# EAGLE schematic gL_control_PCB (EAGLE 7.7.0)
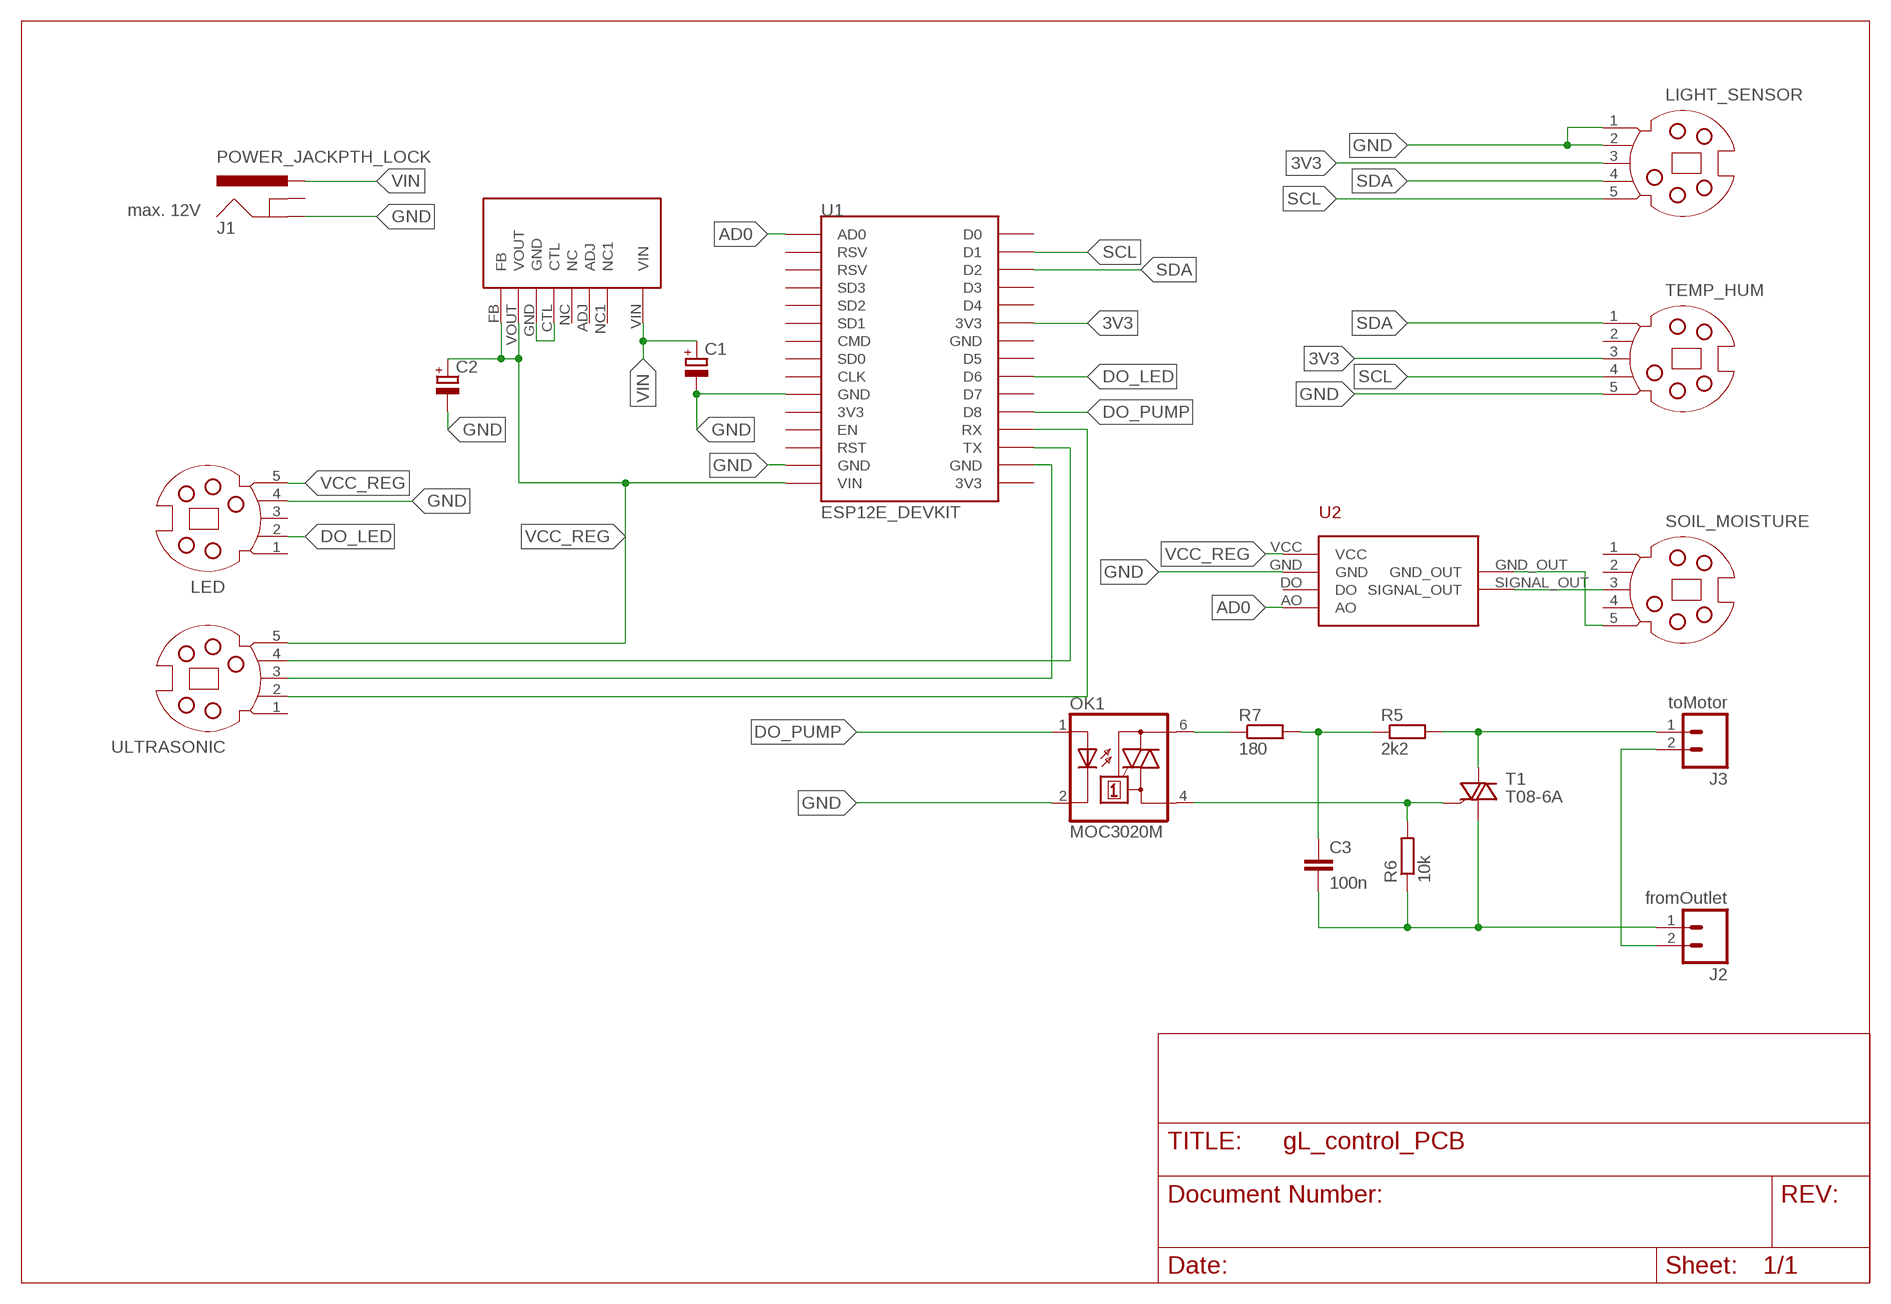
[diagram p0: schematic, sheet 1]

## Parts
C1  CPOL-EUE2.5-5  [E2,5-5]
C2  CPOL-EUE5-8.5  [E5-8,5]
C3  100n  C7.5/5  [C7.5B5]
J1  POWER_JACKPTH_LOCK  [POWER_JACK_PTH_LOCK]
J2  fromOutlet  M025MM  [SCREWTERMINAL-5MM-2]
J3  toMotor  M025MM  [SCREWTERMINAL-5MM-2]
LED  MD05SS  [MDIN05SS]
LIGHT_SENSOR  MD05SS  [MDIN05SS]
OK1  MOC3020M  [DIL06]
R5  2k2  R-EU_0309/10  [0309/10]
R6  10k  R-EU_0309/10  [0309/10]
R7  180  R-EU_0309/10  [0309/10]
SOIL_MOISTURE  MD05SS  [MDIN05SS]
T1  T08-6A  [TO92-3]
TEMP_HUM  MD05SS  [MDIN05SS]
U1  ESP12E_DEVKIT  [ESP12E_DEVKIT]
U2  LM393_SOIL_MOISTURE  [LM393_SOIL_SENSOR]
U$1  BH5220A  [BH5220A]
ULTRASONIC  MD05SS  [MDIN05SS]

## Nets
3V3: LIGHT_SENSOR.3 TEMP_HUM.3 U1.3V3@1(3V3)
AD0: U1.AD0 U2.AO
DO_LED: LED.2 U1.D6
DO_PUMP: OK1.1(A) U1.D8
GND: C1.- C2.- J1.GND LED.4 LIGHT_SENSOR.1 LIGHT_SENSOR.2 OK1.2(C) TEMP_HUM.5 U1.GND@0(GND) U1.GND@1(GND) U2.GND
N$1: SOIL_MOISTURE.5 U2.GND_OUT
N$2: U1.GND@3(GND) ULTRASONIC.3
N$3: SOIL_MOISTURE.3 U2.SIGNAL_OUT
N$5: U1.TX ULTRASONIC.4
N$6: U1.RX ULTRASONIC.2
N$7: U$1.CTL U$1.GND
N$20: J2.2 J3.2
N$23: C3.2 J2.1 R6.1 T1.A2(A1)
N$24: J3.1 R5.2 T1.A1(A2)
N$25: OK1.6(A2) R7.1
N$26: C3.1 R5.1 R7.2
N$27: OK1.4(A1) R6.2 T1.G
SCL: LIGHT_SENSOR.5 TEMP_HUM.4 U1.D1
SDA: LIGHT_SENSOR.4 TEMP_HUM.1 U1.D2
VCC_REG: C2.+ LED.5 U1.VIN U2.VCC U$1.FB U$1.VOUT ULTRASONIC.5
VIN: C1.+ J1.PWR U$1.VIN
Unconnected: J1.GNDBREAK LED.1 LED.3 SOIL_MOISTURE.1 SOIL_MOISTURE.2 SOIL_MOISTURE.4 TEMP_HUM.2 U1.3V3@0(3V3) U1.3V3@2(3V3) U1.CLK U1.CMD U1.D0 U1.D3 U1.D4 U1.D5 U1.D7 U1.EN U1.GND@2(GND) U1.RST U1.RSV@0(RSV) U1.RSV@1(RSV) U1.SD0 U1.SD1 U1.SD2 U1.SD3 U2.DO U$1.ADJ U$1.NC U$1.NC1 ULTRASONIC.1

## Notes on the sheet
- max. 12V

## Library data of the parts
C1 C2 = resistor:CPOL-EU: POLARIZED CAPACITOR, European symbol
C3 = capacitor-wima:C: CAPACITOR naming: grid - package width
J1 = SparkFun-Connectors:POWER_JACK: Power Jack This is the standard 5.5mm barrel jack for power. The PTH is the most common, proven, reliable, footprint. The Slot footprint only works if the mill layer is transmitted to the PCB fab house so be warned. Mating wall wart : TOL-00298 (and others); PROD_ID: CONN-08197; SF_ID: PRT-00119
J2 J3 = SparkFun-Connectors:M02: Standard 2-pin 0.1" header. Use with - straight break away headers ( PRT-00116) - right angle break away headers (PRT-00553) - swiss pins (PRT-00743) - machine pins (PRT-00117) - female headers (PRT-00115) Molex polarized connector foot print use with: PRT-08233 with associated crimp pins and housings. 2.54_SCREWTERM for use with PRT-10571. 3.5mm Screw Terminal footprints for PRT-08084 5mm Screw Terminal footprints for use with PRT-08432; STOREFRONT_ID: PRT-08432
LED LIGHT_SENSOR SOIL_MOISTURE TEMP_HUM ULTRASONIC = con-yamaichi:MD05SS: YAMAICHI CONNECTOR; OC_FARNELL: unknown; OC_NEWARK: unknown
OK1 = optocoupler:MOC30*M: RANDOM-PHASE OPTOISOLATORS TRIAC DRIVER OUTPUT Source: http://www.fairchildsemi.com MOC3020-M.pdf; MF: FAIRCHILD SEMICONDUCTOR; MPN: MOC3020-M; OC_FARNELL: 1505425; OC_NEWARK: 72K8895
R5-R7 = resistor:R-EU_: RESISTOR, European symbol
T1 = triac:T08-6A
U1 = ESP12E_DEVKIT:ESP12E_DEVKIT: ESP12E DEVKIT BOARD
U2 = soil_moisture_sensor:LM393_SOIL_MOISTURE: LM393 - comparator board for soilmoisture sensor
U$1 = bh5220a:BH5220A: DC/DC converter